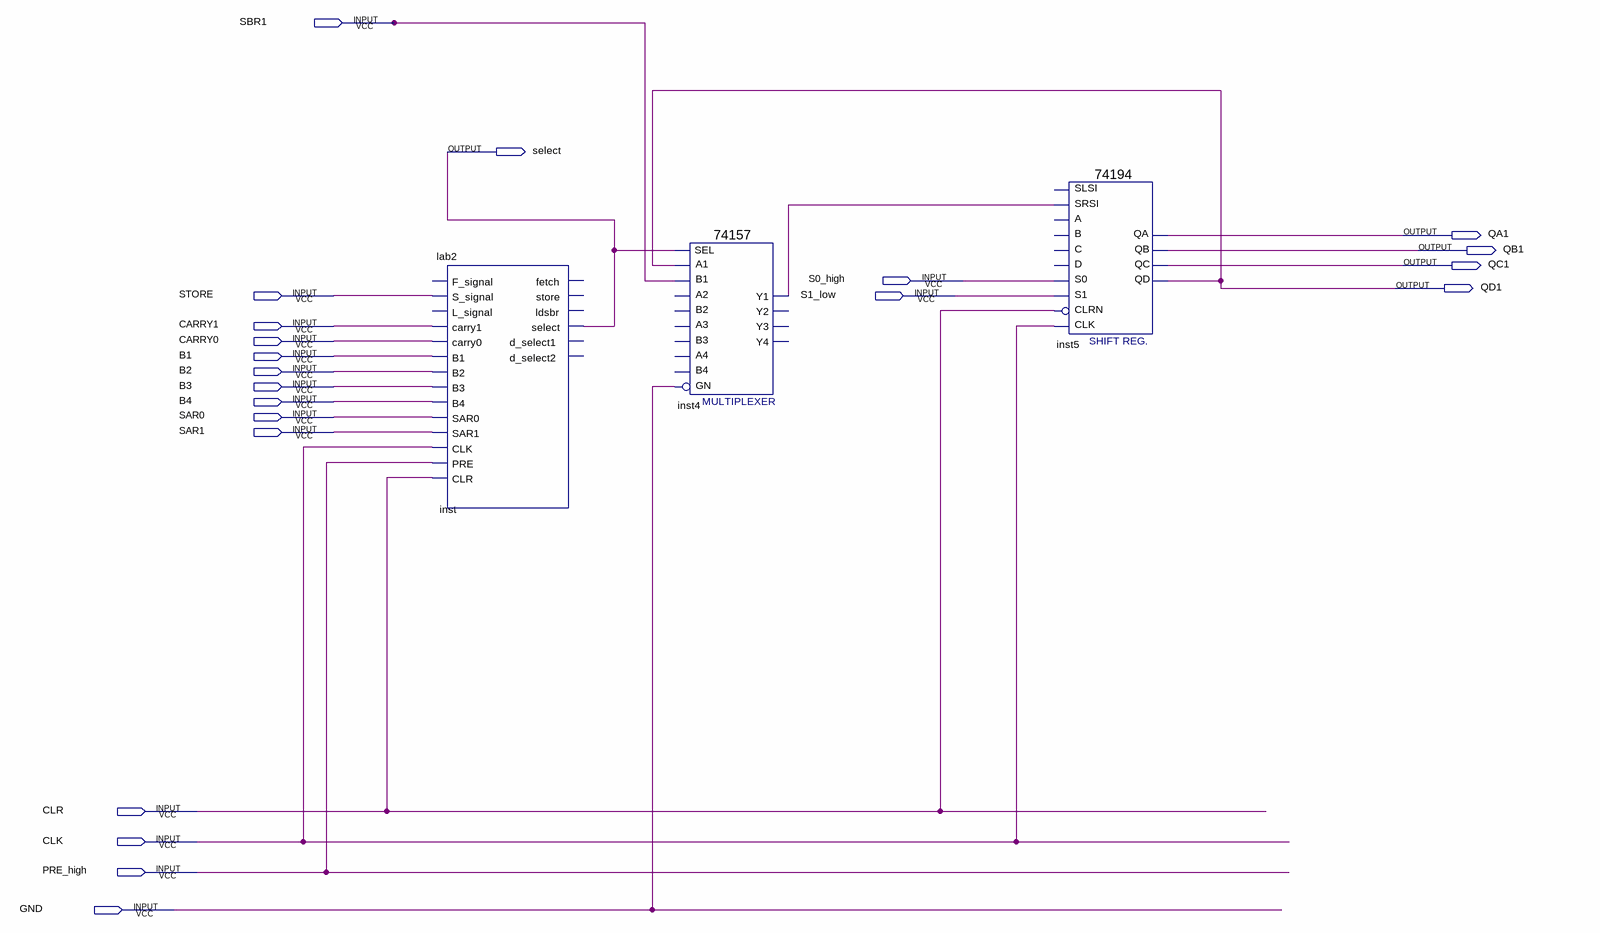
[diagram p0: schematic sheet]
// Quartus schematic Block10.bdf as structural Verilog: 3 symbols, 21 pins
module Block10 (
  input  SBR1,
  input  S0_high,
  input  STORE,
  input  S1_low,
  input  CARRY1,
  input  CARRY0,
  input  B1,
  input  B2,
  input  B3,
  input  B4,
  input  SAR0,
  input  SAR1,
  input  CLR,
  input  CLK,
  input  PRE_high,
  input  GND,
  output select,
  output QA1,
  output QB1,
  output QC1,
  output QD1
);

  wire inst4_y1;

  lab2 inst (
    .S_signal(STORE), .carry1(CARRY1), .carry0(CARRY0), .B1(B1), .B2(B2), .B3(B3), .B4(B4), .SAR0(SAR0),
    .SAR1(SAR1), .CLK(CLK), .PRE(PRE_high), .CLR(CLR), .select(select));  // open: F_signal, L_signal, fetch, store, ldsbr, d_select1, d_select2
  \74157  inst4 (
    .A1(QD1), .B1(SBR1), .SEL(select), .GN(GND), .Y1(inst4_y1));  // open: B2, A3, B3, A2, B4, A4, Y2, Y4, Y3
  \74194  inst5 (
    .SRSI(inst4_y1), .CLK(CLK), .CLRN(CLR), .S1(S1_low), .S0(S0_high), .QA(QA1), .QB(QB1), .QC(QC1), .QD(QD1));  // open: SLSI, B, C, D, A
endmodule
